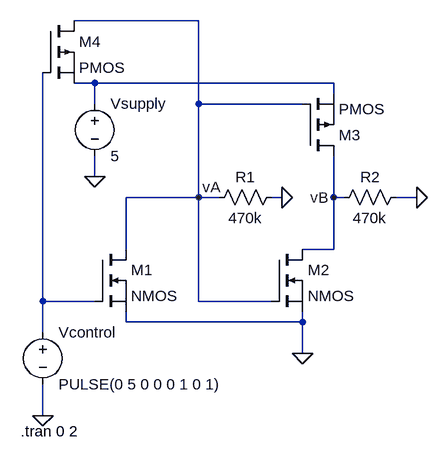
[diagram p0: schematic project2_q2.asc]
project2_q2.asc, the LTspice schematic file:
Version 4
SHEET 1 880 680
WIRE 176 -496 -16 -496
WIRE 16 -400 -16 -400
WIRE 384 -400 16 -400
WIRE 384 -384 384 -400
WIRE 16 -368 16 -400
WIRE 176 -368 176 -496
WIRE 336 -368 176 -368
WIRE 16 -256 16 -288
WIRE 176 -224 176 -368
WIRE 176 -224 64 -224
WIRE 208 -224 176 -224
WIRE 304 -224 288 -224
WIRE 384 -224 384 -288
WIRE 400 -224 384 -224
WIRE 512 -224 480 -224
WIRE 64 -144 64 -224
WIRE 384 -144 384 -224
WIRE 384 -144 336 -144
WIRE -64 -64 -64 -416
WIRE 16 -64 -64 -64
WIRE 176 -64 176 -224
WIRE 288 -64 176 -64
WIRE 64 -32 64 -48
WIRE 336 -32 336 -48
WIRE 336 -32 64 -32
WIRE -64 -16 -64 -64
WIRE 336 16 336 -32
WIRE -64 112 -64 64
FLAG -64 112 0
FLAG 16 -256 0
FLAG 336 16 0
FLAG 304 -224 0
FLAG 512 -224 0
FLAG 384 -224 vB
FLAG 176 -224 vA
SYMBOL nmos 16 -144 R0
SYMATTR InstName M1
SYMBOL nmos 288 -144 R0
SYMATTR InstName M2
SYMBOL pmos 336 -288 M180
SYMATTR InstName M3
SYMBOL pmos -64 -496 R0
SYMATTR InstName M4
SYMBOL voltage -64 -32 R0
WINDOW 123 0 0 Left 0
WINDOW 39 0 0 Left 0
SYMATTR InstName Vcontrol
SYMATTR Value PULSE(0 5 0 0 0 1 0 1)
SYMBOL voltage 16 -384 R0
WINDOW 123 0 0 Left 0
WINDOW 39 0 0 Left 0
SYMATTR InstName Vsupply
SYMATTR Value 5
SYMBOL res 304 -240 R90
WINDOW 0 0 56 VBottom 2
WINDOW 3 32 56 VTop 2
SYMATTR InstName R1
SYMATTR Value 470k
SYMBOL res 496 -240 R90
WINDOW 0 0 56 VBottom 2
WINDOW 3 32 56 VTop 2
SYMATTR InstName R2
SYMATTR Value 470k
TEXT -98 136 Left 2 !.tran 0 2

The netlist it stands for:
* project2_q2.asc
M1 vA N002 0 0 NMOS
M2 vB vA 0 0 NMOS
M3 vB vA N001 N001 PMOS
M4 vA N002 N001 N001 PMOS
Vcontrol N002 0 PULSE(0 5 0 0 0 1 0 1)
Vsupply N001 0 5
R1 0 vA 470k
R2 0 vB 470k
.model NMOS NMOS
.model PMOS PMOS
.lib standard.mos
.tran 0 2
.backanno
.end